# EAGLE design main (EAGLE 7.2.0)
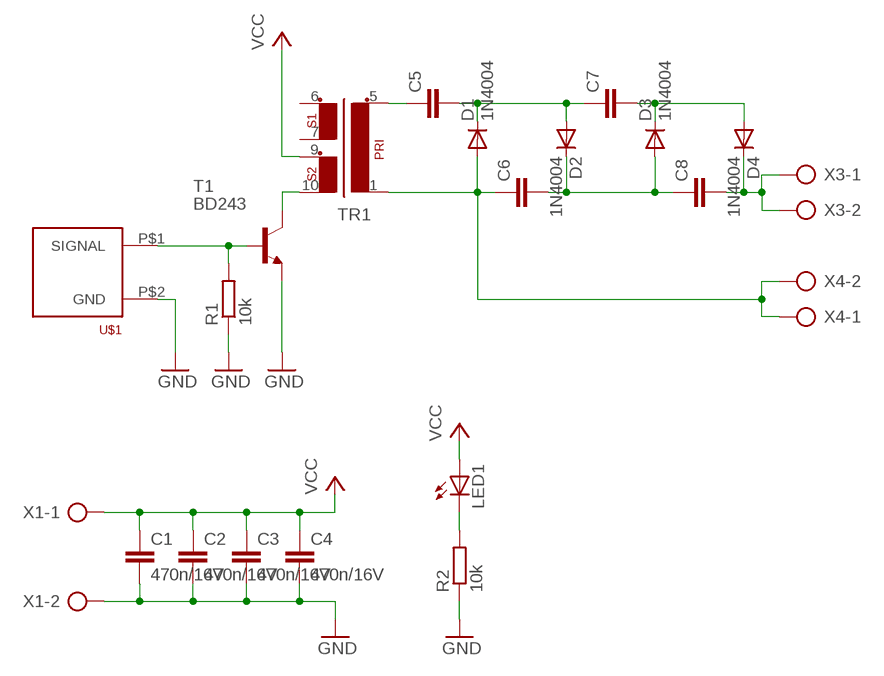
[diagram p0: schematic, sheet 1]

## Parts
C1  470n/16V  C-EU025-025X050  [C025-025X050]
C2  470n/16V  C-EU025-025X050  [C025-025X050]
C3  470n/16V  C-EU025-025X050  [C025-025X050]
C4  470n/16V  C-EU025-025X050  [C025-025X050]
C5  C-EU150-064X183  [C150-064X183]
C6  C-EU150-064X183  [C150-064X183]
C7  C-EU150-064X183  [C150-064X183]
C8  C-EU150-064X183  [C150-064X183]
D1  1N4004  [DO41-10]
D2  1N4004  [DO41-10]
D3  1N4004  [DO41-10]
D4  1N4004  [DO41-10]
LED1  LED3MM  [LED3MM]
R1  10k  R-EU_M1206  [M1206]
R2  10k  R-EU_M1206  [M1206]
T1  BD243  [TO220]
TR1  EI30-2  [EI30-2]
U$1  BNC_VERTICAL  [BNC_VERTICAL]
X1  AK500/2-H  [AK500/2-H]
X3  AK500/2-H  [AK500/2-H]
X4  AK500/2-H  [AK500/2-H]

## Nets
GND: C1.2 C2.2 C3.2 C4.2 R1.1 R2.1 T1.3(E) U$1.P$2(GND) X1.2
N$1: C6.1 D1.A TR1.1 X4.1 X4.2
N$2: C5.2 C7.1 D1.C D2.A
N$3: C6.2 C8.1 D2.C D3.A
N$4: C7.2 D3.C D4.A
N$5: C8.2 D4.C X3.1 X3.2
N$6: C5.1 TR1.5
N$7: T1.2(C) TR1.10
N$8: LED1.K(C) R2.2
N$9: R1.2 T1.1(B) U$1.P$1(SIGNAL)
VCC: C1.1 C2.1 C3.1 C4.1 LED1.A TR1.9 X1.1
Unconnected: TR1.6 TR1.7

## Library data of the parts
C1-C8 = resistor:C-EU: CAPACITOR, European symbol
D1-D4 = diode:1N4004: DIODE general purpose rectifier, 1 A
LED1 = led:LED: LED OSRAM: - CHIPLED LG R971, LG N971, LY N971, LG Q971, LY Q971, LO R971, LY R971 LH N974, LH R974 LS Q976, LO Q976, LY Q976 LO Q996 - Hyper CHIPLED LW Q18S LB Q993, LB Q99A, LB R99A - SideLED LS A670, LO A670, LY A670, LG A670, LP A670 LB A673, LV A673, LT A673, LW A673 LH A674 LY A675 LS A676, LA A676, LO A676, LY A676, LW A676 LS A679, LY A679, LG A679 - Hyper Micro SIDELED® LS Y876, LA Y876, LO Y876, LY Y876 LT Y87S - SmartLED LW L88C, LW L88S LB L89C, LB L89S, LG L890 LS L89K, LO L89K, LY L89K LS L896, LA L896, LO L896, LY L896 - TOPLED LS T670, LO T670, LY T670, LG T670, LP T670 LSG T670, LSP T670, LSY T670, LOP T670, LYG T670 LG T671, LOG T671, LSG T671 LB T673, LV T673, LT T673, LW T673 LH T674 LS T676, LA T676, LO T676, LY T676, LB T676, LH T676, LSB T676, LW T676 LB T67C, LV T67C, LT T67C, LS T67K, LO T67K, LY T67K, LW E67C LS E67B, LA E67B, LO E67B, LY E67B, LB E67C, LV E67C, LT E67C LW T67C LS T679, LY T679, LG T679 LS T770, LO T770, LY T770, LG T770, LP T770 LB T773, LV T773, LT T773, LW T773 LH T774 LS E675, LA E675, LY E675, LS T675 LS T776, LA T776, LO T776, LY T776, LB T776 LHGB T686 LT T68C, LB T68C - Hyper Mini TOPLED® LB M676 - Mini TOPLED Santana® LG M470 LS M47K, LO M47K, LY M47K Source: http://www.osram.convergy.de LUXEON: - LUMILED® LXK2-PW12-R00, LXK2-PW12-S00, LXK2-PW14-U00, LXK2-PW14-V00 LXK2-PM12-R00, LXK2-PM12-S00, LXK2-PM14-U00 LXK2-PE12-Q00, LXK2-PE12-R00, LXK2-PE12-S00, LXK2-PE14-T00, LXK2-PE14-U00 LXK2-PB12-K00, LXK2-PB12-L00, LXK2-PB12-M00, LXK2-PB14-N00, LXK2-PB14-P00, LXK2-PB14-Q00 LXK2-PR12-L00, LXK2-PR12-M00, LXK2-PR14-Q00, LXK2-PR14-R00 LXK2-PD12-Q00, LXK2-PD12-R00, LXK2-PD12-S00 LXK2-PH12-R00, LXK2-PH12-S00 LXK2-PL12-P00, LXK2-PL12-Q00, LXK2-PL12-R00 Source: www.luxeon.com KINGBRIGHT: KA-3528ASYC Source: www.kingbright.com
R1 R2 = resistor:R-EU_: RESISTOR, European symbol
T1 = transistor:BD243: NPN TRANSISTOR Source: Motorola Semiconductor, Master Selection Guide Q3/95 SG73 REV 8 page 5.5-4
TR1 = trafo:EI30-2: TRANSFORMER 1 primary winding, 2 secondary windings ERA
U$1 = connectors:BNC_VERTICAL: BNC plug, through-hole, vertical
X1 X3 X4 = con-ptr500:AK500/2-H: CONNECTOR Aug. 2004 / PTR Meßtechnik: Die Bezeichnung der Serie AK505 wurde geändert. Es handelt sich hierbei um AK500 in horizontaler Ausführung.; OC_FARNELL: unknown; OC_NEWARK: unknown

## Board
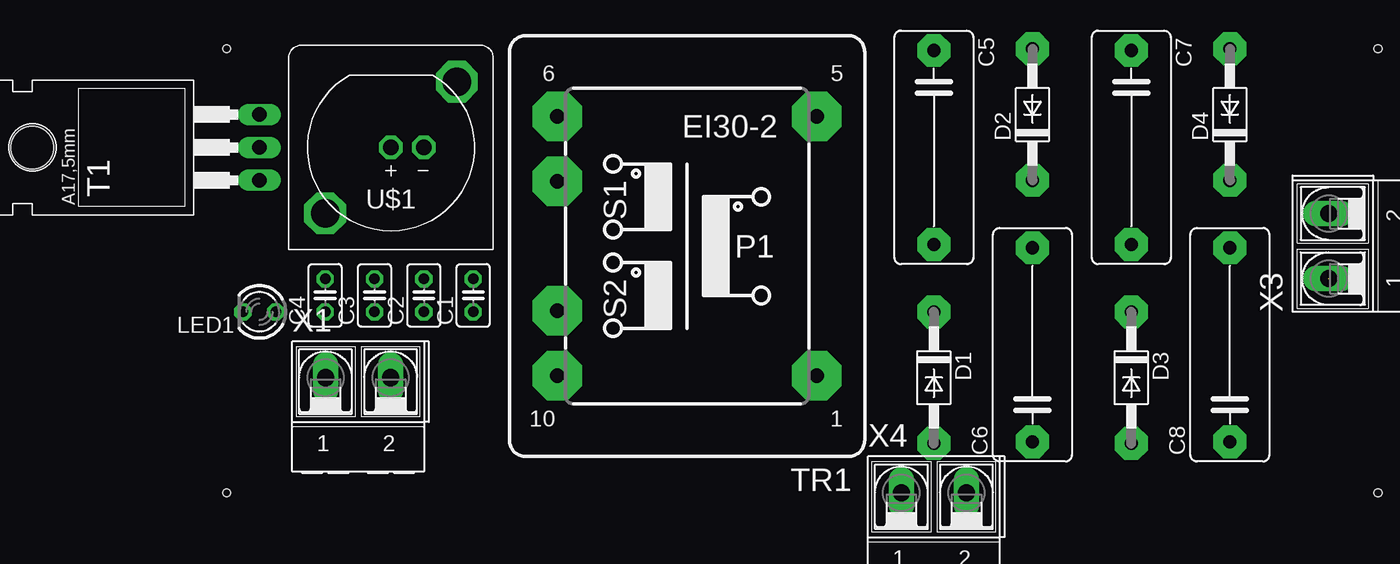
[diagram p1: board, top side]
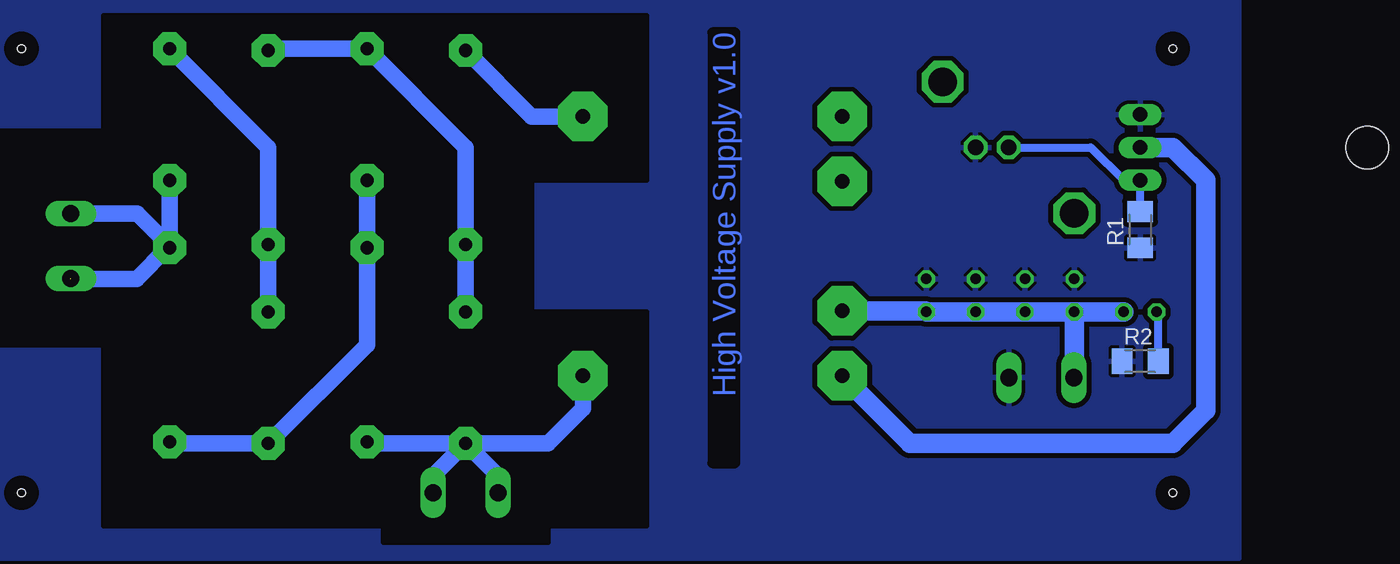
[diagram p2: board, bottom side, seen from below]

No outline drawn. Coordinates in mm, seen from the top.
Copper layers (1*16): Top 0.035mm / dielectric 1.5mm / Bottom 0.035mm
Design rules "default *": minimum track width 10mil, minimum drill 24mil, track to track 15mil, track to pad 15mil, pad to pad 8mil, via to via 8mil, smd to smd 8mil, copper to edge 40mil, drill to drill 8mil, minimum pad ring 10mil, minimum via ring 8mil, stop-mask expansion 4mil, vias tented up to drill 0mil, thermal gap 10mil
Holes 0.6 mm at 5.08,39.37 5.08,5.08 93.98,5.08 93.98,39.37
bRestrict: area 45.7,1.3 to 96.5,41.9

### Footprints (pad centres in the part's own frame; a part is rotated, then mirrored left to right if it is on the bottom)
C025-025X050 = drill 0.813 octagon: 1 -1.27,0; 2 1.27,0
C150-064X183 = drill 1.016 pad 2.54 octagon: 1 -7.493,0; 2 7.493,0
DO41-10 = drill 1.016 pad 2.54 octagon: A 5.08,0; C -5.08,0
LED3MM = drill 0.813 octagon: A -1.27,0; K 1.27,0
M1206 = smd 1.6 x 2: 1 -1.4,0; 2 1.4,0
TO220 = drill 1.118 long: 1 -2.54,-6.35; 2 0,-6.35; 3 2.54,-6.35 | hole 3.302: 0,11.176
EI30-2 = drill 1.118 pad 3.81 octagon: 1 -10.008,10.008; 5 -10.008,-10.008; 6 10.008,-10.008; 7 10.008,-5.004; 9 10.008,5.004; 10 10.008,10.008
BNC_VERTICAL = drill 1.2 octagon: P$1 0,0; P$2 2.54,0 | drill 2.2 octagon: P$3 5.08,5.08; P$4 -5.08,-5.08
AK500/2-H = drill 1.321 long: 1 -2.515,0; 2 2.515,0

### Placement (x,y rotation side)
C1  24.13,20.32 90 top
C2  20.32,20.32 90 top
C3  16.51,20.32 90 top
C4  12.7,20.32 90 top
C5  59.69,31.75 270 top
C6  67.31,16.51 90 top
C7  74.93,31.75 270 top
C8  82.55,16.51 90 top
D1  59.69,13.97 270 top
D2  67.31,34.29 90 top
D3  74.93,13.97 270 top
D4  82.55,34.29 90 top
LED1  7.62,19.05 180 top
R1  7.62,25.4 90 bottom
R2  7.62,15.24 0 bottom
T1  1.27,31.75 90 top
TR1  40.64,24.13 180 top
U$1  17.78,31.75 0 top
X1  15.24,13.97 0 top
X3  90.17,24.13 90 top
X4  59.69,5.08 0 top

### Tracks (layer width: path | path; a pad name or v marks a point on that pad's centre or on a via)
GND
  pour Bottom: 0,0 0,44.45 99.06,44.45 99.06,0
N$1
  Bottom 1.27: TR1.1 50.65,11.58 53.34,8.89 D1.A | D1.A 67.18,8.89 C6.1 | X4.2 62.2,6.38 D1.A | D1.A 57.15,6.35 57.15,5.11 X4.1
N$2
  Bottom 1.27: D1.C C5.2 59.69,31.75 D2.A 74.8,39.37 C7.1
N$3
  Bottom 1.27: D2.C C6.2 67.31,16.51 D3.A 82.42,8.89 C8.1
N$4
  Bottom 1.27: D3.C C7.2 74.93,31.75 D4.A
N$5  (1 unrouted)
  Bottom 1.27: D4.C 82.55,24.13 | 90.17,21.59 85.09,21.59 82.68,24 C8.2 82.55,24.13 | X3.2 85.06,26.64 82.55,24.13
N$6
  Bottom 1.27: TR1.5 54.59,34.14 C5.1
N$7
  Bottom 1.524: T1.2 5.08,31.75 2.54,29.21 2.54,11.43 5.08,8.89 25.4,8.89 TR1.10
N$8
  Bottom 0.61: R2.2 6.22,18.92 LED1.K
N$9
  Bottom 0.61: U$1.P$1 11.43,31.75 8.89,29.21 T1.1 R1.2
VCC
  Bottom 1.524: TR1.9 24.21,19.13 C1.1 C2.1 C3.1 C4.1 | C4.1 12.7,13.99 X1.1 | C4.1 LED1.A

### Text on the board
Bottom: High Voltage Supply v1.0